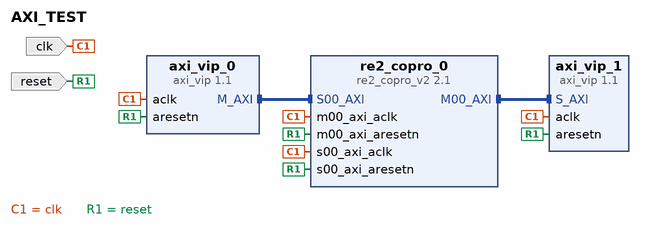
[diagram p0: block diagram of the top level]
# Vivado block design AXI_TEST, xczu3eg-sbva484-1-i, Vivado 2025.1
create_bd_design AXI_TEST

create_bd_port -dir I -type clk clk
create_bd_port -dir I -type rst reset

create_bd_cell -type ip -vlnv xilinx.com:ip:axi_vip:1.1 axi_vip_0
set_property -dict [list \
  CONFIG.ADDR_WIDTH 32 \
  CONFIG.DATA_WIDTH 32 \
  CONFIG.HAS_BRESP 1 \
  CONFIG.HAS_PROT 1 \
  CONFIG.HAS_RRESP 1 \
  CONFIG.HAS_WSTRB 1 \
  CONFIG.INTERFACE_MODE MASTER \
  CONFIG.PROTOCOL AXI4LITE \
  CONFIG.READ_WRITE_MODE READ_WRITE \
] [get_bd_cells axi_vip_0]
create_bd_cell -type ip -vlnv user.org:user:re2_copro_v2:2.1 re2_copro_0
create_bd_cell -type ip -vlnv xilinx.com:ip:axi_vip:1.1 axi_vip_1
set_property -dict {CONFIG.INTERFACE_MODE SLAVE CONFIG.READ_WRITE_MODE READ_ONLY} [get_bd_cells axi_vip_1]

# ---- connections ----

connect_bd_intf_net [get_bd_intf_pins axi_vip_0/M_AXI] [get_bd_intf_pins re2_copro_0/S00_AXI]
connect_bd_intf_net [get_bd_intf_pins axi_vip_1/S_AXI] [get_bd_intf_pins re2_copro_0/M00_AXI]
connect_bd_net -net aclk_0_1 [get_bd_ports clk] \
  [get_bd_pins axi_vip_0/aclk] [get_bd_pins axi_vip_1/aclk] [get_bd_pins re2_copro_0/m00_axi_aclk] \
  [get_bd_pins re2_copro_0/s00_axi_aclk]
connect_bd_net -net aresetn_0_1 [get_bd_ports reset] \
  [get_bd_pins axi_vip_0/aresetn] [get_bd_pins axi_vip_1/aresetn] [get_bd_pins re2_copro_0/m00_axi_aresetn] \
  [get_bd_pins re2_copro_0/s00_axi_aresetn]

# ---- address map ----
assign_bd_address -offset 0x44A00000 -range 64K -target_address_space [get_bd_addr_spaces axi_vip_0/Master_AXI] [get_bd_addr_segs re2_copro_0/S00_AXI/S00_AXI_reg]
assign_bd_address -offset 0x40000000 -range 64K -target_address_space [get_bd_addr_spaces re2_copro_0/M00_AXI] [get_bd_addr_segs axi_vip_1/S_AXI/Reg]

validate_bd_design
save_bd_design
